# EAGLE design ALU_1_0 (EAGLE 8.3.2)
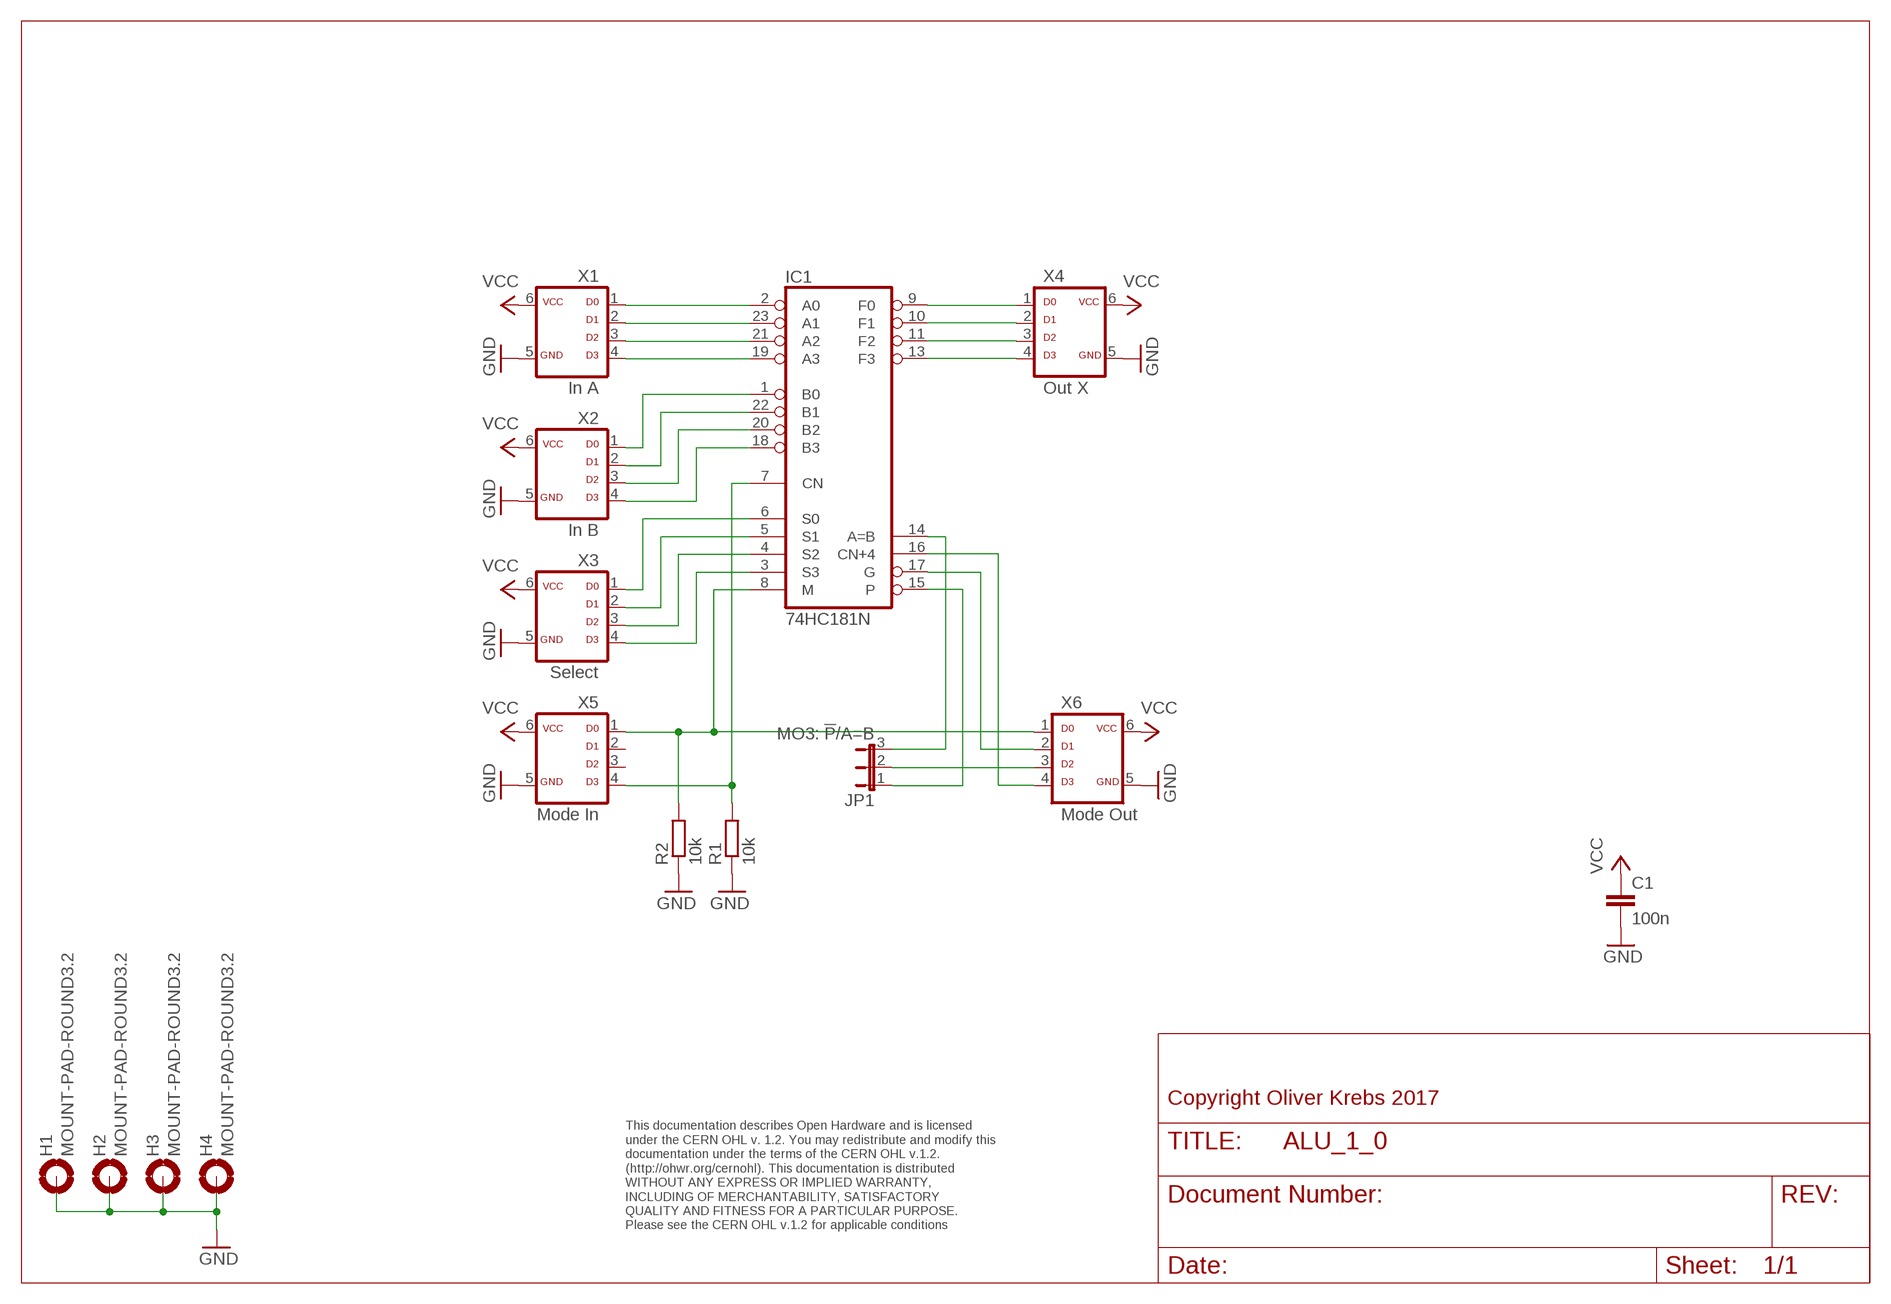
[diagram p0: schematic, sheet 1]

## Parts
C1  100n  C-EU050-025X075  [C050-025X075]
H1  MOUNT-PAD-ROUND3.2  [3,2-PAD]
H2  MOUNT-PAD-ROUND3.2  [3,2-PAD]
H3  MOUNT-PAD-ROUND3.2  [3,2-PAD]
H4  MOUNT-PAD-ROUND3.2  [3,2-PAD]
IC1  74HC181N  [DIL24-6]
JP1  MO3: !P!/A=B  JP2EJP2  [JP2]
R1  10k  R-EU_0207/10  [0207/10]
R2  10k  R-EU_0207/10  [0207/10]
X1  In A  ML6D  [ML-6]
X2  In B  ML6D  [ML-6]
X3  Select  ML6D  [ML-6]
X4  Out X  ML6D  [ML-6]
X5  Mode In  ML6D  [ML-6]
X6  Mode Out  ML6D  [ML-6]

## Nets
GND: C1.2 H1.B3,2(MOUNT) H2.B3,2(MOUNT) H3.B3,2(MOUNT) H4.B3,2(MOUNT) R1.1 R2.1 X1.5 X2.5 X3.5 X4.5 X5.5 X6.5
N$1: IC1.9(F0) X4.1
N$2: IC1.10(F1) X4.2
N$3: IC1.11(F2) X4.3
N$4: IC1.13(F3) X4.4
N$5: IC1.2(A0) X1.1
N$6: IC1.23(A1) X1.2
N$7: IC1.21(A2) X1.3
N$8: IC1.19(A3) X1.4
N$9: IC1.1(B0) X2.1
N$10: IC1.22(B1) X2.2
N$11: IC1.20(B2) X2.3
N$12: IC1.18(B3) X2.4
N$13: IC1.6(S0) X3.1
N$14: IC1.5(S1) X3.2
N$15: IC1.4(S2) X3.3
N$16: IC1.3(S3) X3.4
N$17: IC1.8(M) R2.2 X5.1 X6.1
N$18: IC1.7(CN) R1.2 X5.4
N$19: IC1.16(CN+4) X6.4
N$20: IC1.15(P) JP1.1
N$21: JP1.2 X6.3
N$22: IC1.14(A=B) JP1.3
N$24: IC1.17(G) X6.2
VCC: C1.1 X1.6 X2.6 X3.6 X4.6 X5.6 X6.6
Unconnected: X5.2 X5.3

## Notes on the sheet
- Copyright Oliver Krebs 2017
- This documentation describes Open Hardware and is licensed 
  under the CERN OHL v. 1.2. You may redistribute and modify this 
  documentation under the terms of the CERN OHL v.1.2. 
  (http://ohwr.org/cernohl). This documentation is distributed
  WITHOUT ANY EXPRESS OR IMPLIED WARRANTY, 
  INCLUDING OF MERCHANTABILITY, SATISFACTORY 
  QUALITY AND FITNESS FOR A PARTICULAR PURPOSE. 
  Please see the CERN OHL v.1.2 for applicable conditions

## Power pins joined to a net without a drawn wire
GND: IC1.12(GND)
VCC: IC1.24(VCC)

## Library data of the parts
C1 = 01-my_rcl:C-EU: CAPACITOR, European symbol
H1-H4 = holes:MOUNT-PAD-ROUND: MOUNTING PAD, round
IC1 = 74xx-eu:74*181: ARITHMETIC LOGIC UNIT function generator
JP1 = 01-my-jumper:JP2E: JUMPER
R1 R2 = 01-my_rcl:R-EU_: RESISTOR, European symbol
X1-X6 = 01-my-con:ML6D

## Board
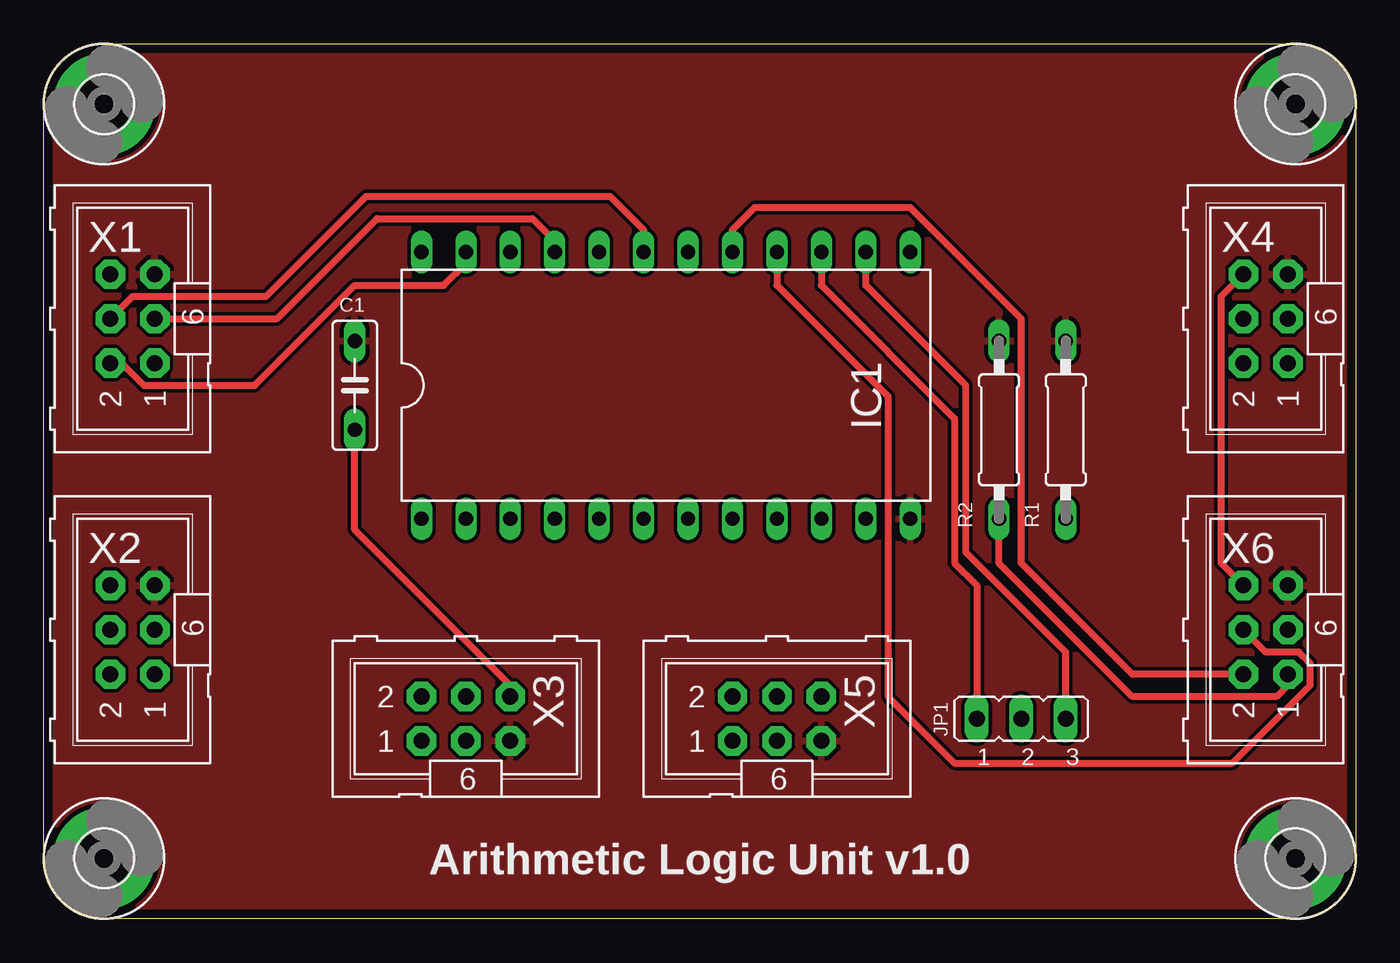
[diagram p1: board, top side]
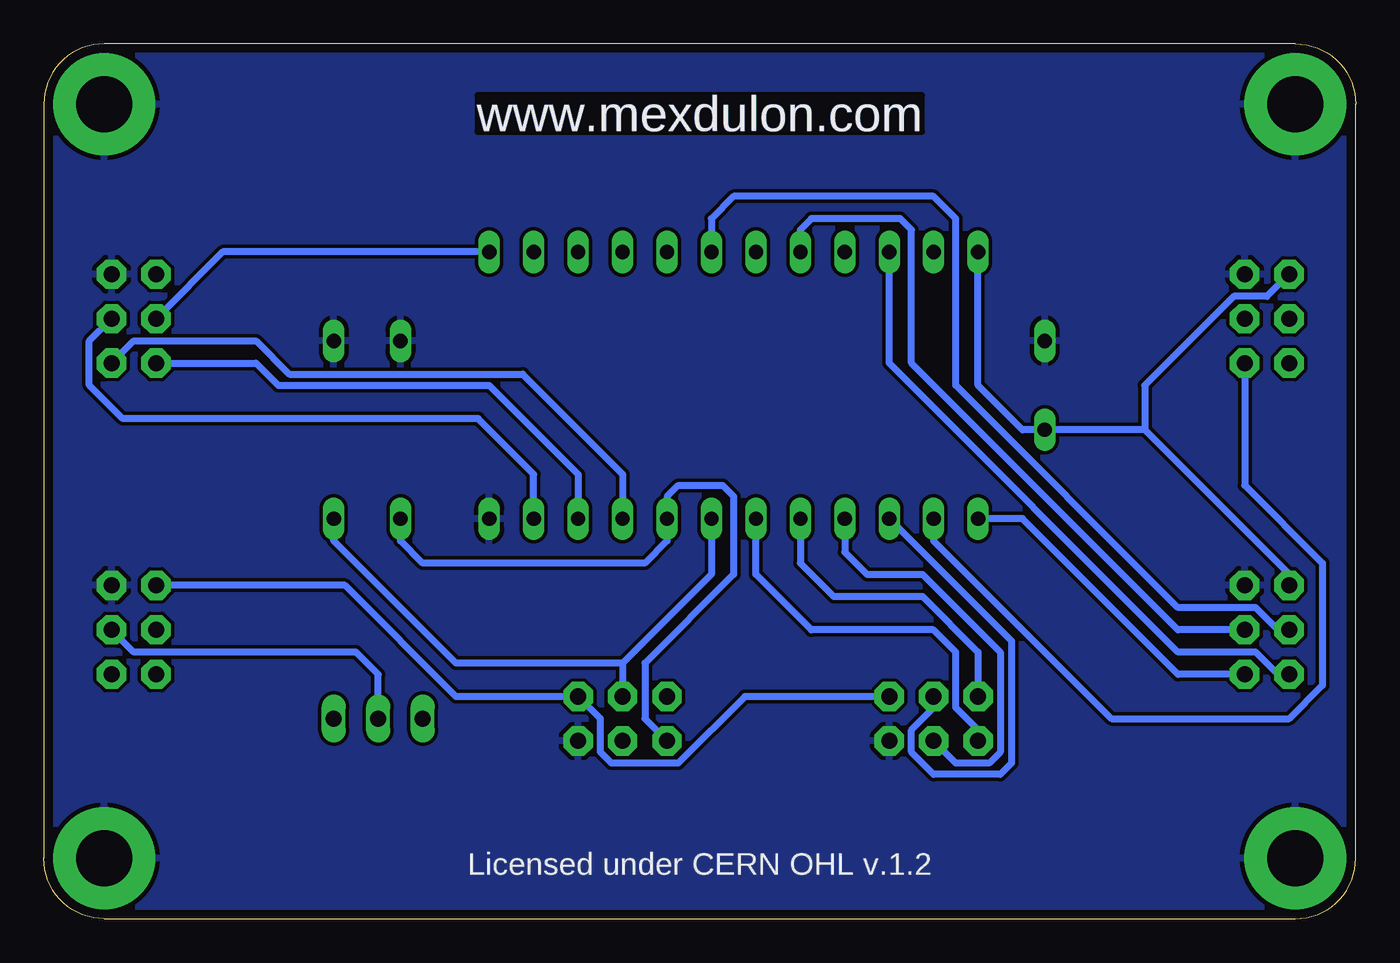
[diagram p2: board, bottom side, seen from below]

Size 75 x 50 mm. Coordinates in mm from the lower left corner, seen from the top.
Outline: 0,3.45 0,46.55 arc-90 3.45,50 71.55,50 arc-90 75,46.55 75,3.45 arc-90 71.55,0 3.45,0 arc-90 0,3.45
Copper layers (1*16): Top 0.035mm / dielectric 1.6mm / Bottom 0.035mm
Design rules "Elecrow_2-layer_PCB_eagle_rule_8mil": minimum track width 8mil, minimum drill 12mil, track to track 8mil, track to pad 8mil, pad to pad 8mil, via to via 8mil, smd to smd 0mil, copper to edge 20mil, drill to drill 10mil, minimum pad ring 6mil, minimum via ring 6mil, stop-mask expansion 0mil, vias tented up to drill 100mil, thermal gap 10mil

### Footprints (pad centres in the part's own frame; a part is rotated, then mirrored left to right if it is on the bottom)
C050-025X075 = drill 0.813 long: 1 -2.54,0; 2 2.54,0
3,2-PAD = drill 3.2 pad 5.842: B3,2 0,0
DIL24-6 = drill 0.813 long: 1 -13.97,-7.62; 2 -11.43,-7.62; 3 -8.89,-7.62; 4 -6.35,-7.62; 5 -3.81,-7.62; 6 -1.27,-7.62; 7 1.27,-7.62; 8 3.81,-7.62; 9 6.35,-7.62; 10 8.89,-7.62; 11 11.43,-7.62; 12 13.97,-7.62; 13 13.97,7.62; 14 11.43,7.62; 15 8.89,7.62; 16 6.35,7.62; 17 3.81,7.62; 18 1.27,7.62; 19 -1.27,7.62; 20 -3.81,7.62; 21 -6.35,7.62; 22 -8.89,7.62; 23 -11.43,7.62; 24 -13.97,7.62
JP2 = drill 0.914 long: 1 -2.54,0; 2 0,0; 3 2.54,0
0207/10 = drill 0.813 long: 1 -5.08,0; 2 5.08,0
ML-6 = drill 0.914 pad 1.676 octagon: 1 -2.54,-1.27; 2 -2.54,1.27; 3 0,-1.27; 4 0,1.27; 5 2.54,-1.27; 6 2.54,1.27

### Placement (x,y rotation side)
C1  17.78,30.48 90 top
H1  3.45,3.45 0 top
H2  3.45,46.55 0 top
H3  71.55,46.55 0 top
H4  71.55,3.45 0 top
IC1  35.56,30.48 0 top
JP1  55.88,11.43 0 top
R1  58.42,27.94 270 top
R2  54.61,27.94 270 top
X1  5.08,34.29 90 top
X2  5.08,16.51 90 top
X3  24.13,11.43 0 top
X4  69.85,34.29 90 top
X5  41.91,11.43 0 top
X6  69.85,16.51 90 top

### Tracks (layer width: path | path; a pad name or v marks a point on that pad's centre or on a via)
GND
  pour Bottom (isolate 0.203): 0,50.16 76.2,50.16 76.2,0 0,0
  pour Top (isolate 0.203): 0,50.16 76.2,50.16 76.2,0 0,0
N$1
  Bottom 0.406: X4.1 69.85,33.02 62.87,33.02 60.96,31.11 47.62,31.11 41.91,25.4 IC1.9
N$2
  Bottom 0.406: X4.2 62.87,31.75 61.59,30.48 49.53,30.48 44.45,25.4 IC1.10
N$3
  Bottom 0.406: IC1.11 46.99,25.4 50.16,28.57 70.48,28.57 72.39,30.48 72.39,33.02 X4.3
N$4
  Bottom 0.406: IC1.13 64.77,38.1 X4.4
N$5
  Bottom 0.406: X1.1 6.35,24.77 1.91,20.32 1.91,13.34 3.81,11.43 13.97,11.43 24.13,21.59 IC1.2
N$6
  Top 0.406: X1.2 4.45,31.75 5.71,30.48 12.06,30.48 17.78,36.2 22.86,36.2 24.13,37.47 IC1.23
N$7
  Top 0.406: X1.3 13.34,34.29 19.05,40.01 27.94,40.01 29.21,38.73 IC1.21
N$8
  Top 0.406: X1.4 5.08,35.56 12.7,35.56 18.41,41.27 32.38,41.27 34.29,39.37 IC1.19
N$9
  Bottom 0.406: X2.1 10.16,13.97 19.05,22.86 IC1.1
N$10
  Bottom 0.406: X2.2 4.45,13.97 5.71,15.24 10.16,15.24 26.67,31.75 IC1.22
N$11
  Bottom 0.406: X2.3 10.16,16.51 25.4,31.75 25.4,39.37 26.04,40.01 31.11,40.01 31.75,39.37 IC1.20
N$12
  Bottom 0.406: X2.4 4.45,16.51 5.71,17.78 10.16,17.78 22.86,30.48 22.86,40.01 24.13,41.27 35.56,41.27 36.83,40.01 IC1.18
N$13
  Bottom 0.406: IC1.6 34.29,19.68 31.11,16.51 24.13,16.51 22.86,15.24 22.86,12.06 21.59,10.79 X3.1
N$14
  Bottom 0.406: IC1.5 31.75,20.32 29.84,18.41 24.77,18.41 21.59,15.24 X3.2
N$15
  Bottom 0.406: IC1.4 29.21,20.95 27.94,19.68 24.77,19.68 20.32,15.24 20.32,9.53 20.95,8.89 22.86,8.89 X3.3
N$16
  Bottom 0.406: X3.4 24.13,12.06 25.4,10.79 25.4,9.53 24.13,8.26 20.32,8.26 19.68,8.89 19.68,15.88 IC1.3
N$17
  Top 0.406: X6.1 71.12,13.34 70.48,12.7 62.23,12.7 54.61,20.32 R2.2
  Bottom 0.406: R2.2 54.61,21.59 53.34,20.32 40.64,20.32 39.37,21.59 IC1.8 39.37,24.13 38.73,24.77 36.2,24.77 35.56,24.13 35.56,19.68 40.64,14.61 40.64,11.43 X5.1
N$18
  Bottom 0.406: IC1.7 36.83,19.68 41.91,14.61 | 41.91,14.61 X5.4 | 41.91,14.61 51.44,14.61 58.42,21.59 R1.2
N$19
  Top 0.406: IC1.16 41.91,36.2 48.26,29.84 48.26,12.7 52.07,8.89 67.94,8.89 72.39,13.34 72.39,14.61 71.75,15.24 69.85,15.24 X6.4
N$20
  Top 0.406: IC1.15 44.45,36.2 52.07,28.57 52.07,20.32 53.34,19.05 JP1.1
N$21
  Bottom 0.406: JP1.2 55.88,13.97 57.15,15.24 69.85,15.24 X6.3
N$22
  Top 0.406: JP1.3 58.42,15.24 52.7,20.95 52.7,30.48 46.99,36.2 IC1.14
N$24
  Top 0.406: X6.2 62.23,13.97 55.88,20.32 55.88,34.29 49.53,40.64 40.64,40.64 39.37,39.37 IC1.17
VCC
  Top 0.406: X3.6 26.67,13.34 17.78,22.23 C1.1 | X6.6 67.31,20.32 67.31,35.56 X4.6
  Bottom 0.406: X2.6 3.81,19.68 12.06,27.94 | 12.06,27.94 C1.1 19.05,27.94 21.59,30.48 IC1.24 | X3.6 34.92,12.7 38.73,8.89 42.55,8.89 43.18,9.53 43.18,11.43 X5.6 51.44,12.7 57.78,19.05 X6.6 | X1.6 5.08,35.56 6.99,35.56 12.06,30.48 12.06,27.94

### Text on the board
Bottom: www.mexdulon.com
tNames: Arithmetic Logic Unit v1.0
bNames: www.mexdulon.com | Licensed under CERN OHL v.1.2
tValues: M1: M / M2: [!G!] / M3: [!P!/A=B] / M4: CN[+4]
200bmp: E:/Bilder/Elektronik/Modulion/Mexdulon/mexdulon_50x50_pcb.bmp